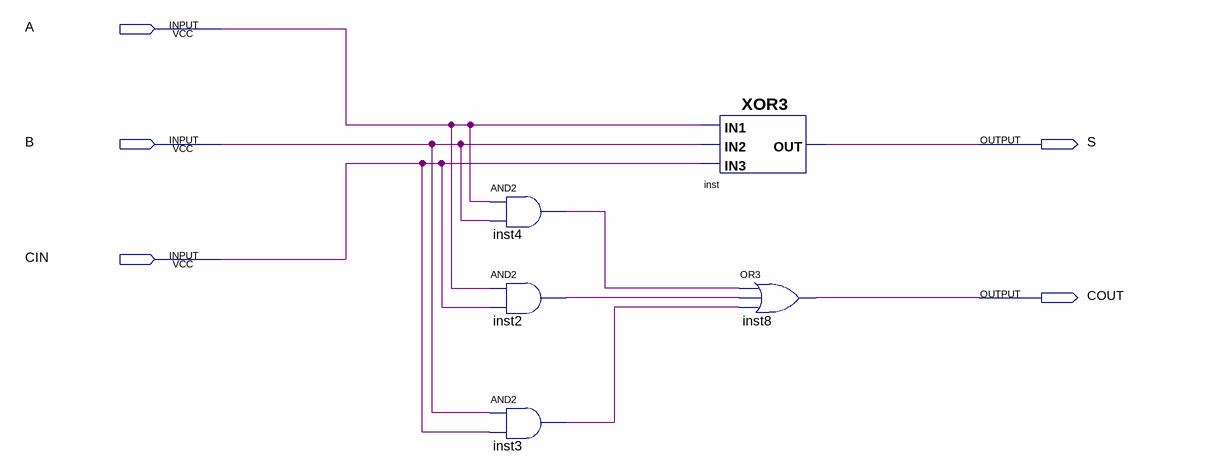
[diagram p0: schematic sheet]
// Quartus schematic HA.bdf as structural Verilog: 5 symbols, 5 pins
module HA (
  input  A,
  input  B,
  input  CIN,
  output S,
  output COUT
);

  wire inst2_out, inst3_out, inst4_out;

  and inst4 (inst4_out, A, B);
  and inst2 (inst2_out, A, CIN);
  and inst3 (inst3_out, B, CIN);
  XOR3 inst (.IN3(CIN), .IN1(A), .IN2(B), .OUT(S));
  or inst8 (COUT, inst4_out, inst2_out, inst3_out);
endmodule
